# EAGLE design schottky (EAGLE 7.4.0)
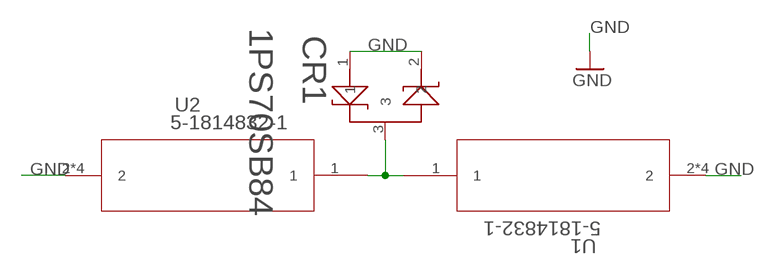
[diagram p0: schematic, sheet 1]

## Parts
CR1  1PS70SB84  [SOT323]
U1  5-1814832-1  [5-1814832-1]
U2  5-1814832-1  [5-1814832-1]

## Nets
GND: CR1.1 CR1.2 U1.2 U1.3 U1.4 U1.5 U2.2 U2.3 U2.4 U2.5
N$1: CR1.3 U1.1 U2.1

## Library data of the parts
CR1 = untitled:1PS70SB84; COPYRIGHT: Copyright (C) 2015 Accelerated Designs. All rights reserved; MANUFACTURER_PART_NUMBER: 1PS70SB84; VENDOR: NXP
U1 U2 = untitled:5-1814832-1; COPYRIGHT: Copyright (C) 2015 Accelerated Designs. All rights reserved; MANUFACTURER_PART_NUMBER: 5-1814832-1; VENDOR: Tyco Electronics

## Board
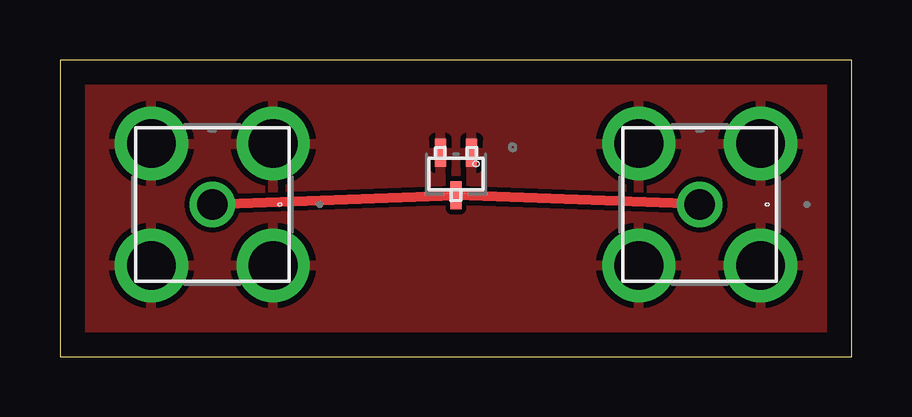
[diagram p1: board, top side]
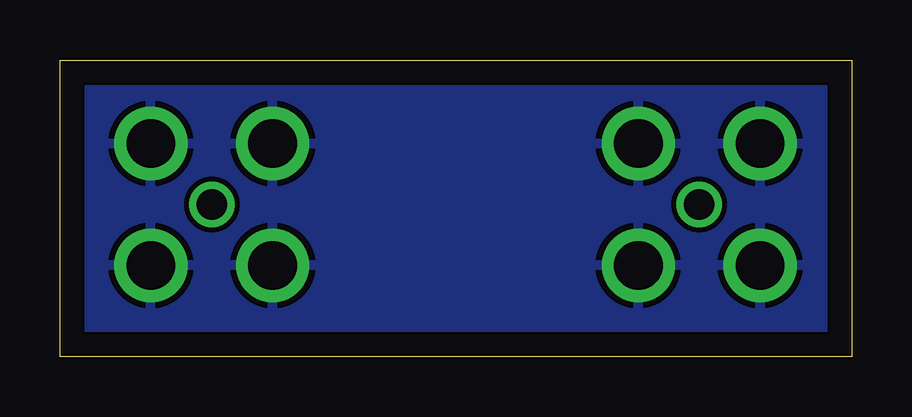
[diagram p2: board, bottom side, seen from below]

Size 33 x 12.37 mm. Coordinates in mm from the lower left corner, seen from the top.
Outline: 0,0 33,0 33,12.37 0,12.37 0,0
Copper layers (1*16): Top 0.035mm / dielectric 1.5mm / Bottom 0.035mm
Design rules "default": minimum track width 10mil, minimum drill 24mil, track to track 8mil, track to pad 8mil, pad to pad 8mil, via to via 8mil, smd to smd 8mil, copper to edge 40mil, drill to drill 8mil, minimum pad ring 10mil, minimum via ring 8mil, stop-mask expansion 4mil, vias tented up to drill 0mil, thermal gap 10mil

### Footprints (pad centres in the part's own frame; a part is rotated, then mirrored left to right if it is on the bottom)
SOT323 = smd 0.457 x 1.168: 1 -0.65,-0.876; 2 0.65,-0.876; 3 0,0.876
5-1814832-1 = drill 1.27 pad 1.778: 1 0,0 | drill 2.032 pad 2.54: 2 -2.54,2.54; 3 -2.54,-2.54; 4 2.54,-2.54; 5 2.54,2.54

### Placement (x,y rotation side)
CR1  16.51,7.62 180 top
U1  6.35,6.35 0 top
U2  26.67,6.35 0 top

### Tracks (layer width: path | path; a pad name or v marks a point on that pad's centre or on a via)
GND
  pour Top: 0,12.7 33.02,12.7 33.02,0 0,0
  pour Bottom: 0,12.7 33.02,12.7 33.02,0 0,0
N$1
  Top 0.406: U1.1 CR1.3 U2.1